# Altium schematic sheet bmp280_i2c.SchDoc
size A4
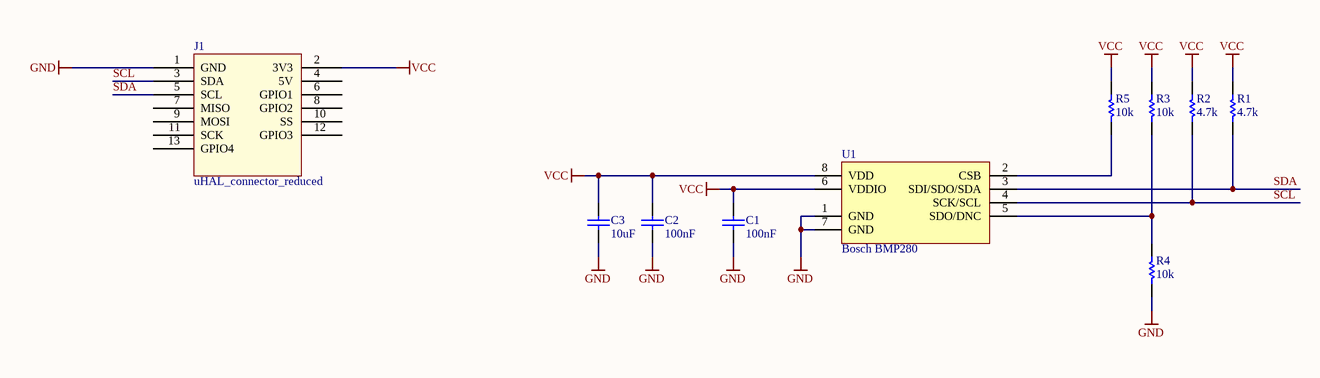
[diagram p0: bmp280_i2c.SchDoc]

## Parts
C1  Capacitance: 100nF  [CAPC1608X90X35ML10T15]  (hidden comment: Murata GCM188R71H104KA57D)
C2  Capacitance: 100nF  [CAPC1608X90X35ML10T15]  (hidden comment: Murata GCM188R71H104KA57D)
C3  Capacitance: 10uF  [CAPC1608X90X35ML10T15]  (hidden comment: Murata GCM188R71H104KA57D)
J1  uHAL_connector_reduced  [PCB-45ncoppm4oopozvqifsq-1]
R1  4.7k  [RESC1608X05N]
R2  4.7k  [RESC1608X05N]
R3  10k  [RESC1608X05N]
R4  10k  [RESC1608X05N]
R5  10k  [RESC1608X05N]
U1  Bosch BMP280  [PCB-7ktgzhb423iat7xn8psi-1]

## Nets
GND: C1.2 C2.2 C3.2 J1.1(GND) R4.1 U1.1(GND) U1.7(GND)
VCC: C1.1 C2.1 C3.1 J1.2(3V3) R1.2 R2.2 R3.2 R5.2 U1.6(VDDIO) U1.8(VDD)
SCL: J1.3(SDA) R2.1 U1.4(SCK/SCL)
SDA: J1.5(SCL) R1.1 U1.3(SDI/SDO/SDA)
NetR3_1: R3.1 R4.2 U1.5(SDO/DNC)
NetR5_1: R5.1 U1.2(CSB)

Not connected (* = marked no-connect by the designer): J1 4(5V) 6(GPIO1) 7(MISO) 8(GPIO2) 9(MOSI) 10(SS) 11(SCK) 12(GPIO3) 13(GPIO4)

## Library data of the parts
C1-C3 = CMP-119667-3: CAP CER 0.1UF 50V 10% X7R 0603; Lead-Free Status: Lead Free; Voltage Rating (DC): 50.0 V; Capacitance Tolerance: ±10%; Dielectric Characteristic: X7R; Octopart Url: https://octopart.com/gcm188r71h104ka57d-murata-7894792; OctopartID: 3480fdf266eeeb47; Packaging: Cut Tape (CT); REACH SVHC Compliance: No SVHC; RoHS: Compliant
J1 = CMP-2q23h2cwhjlfm8s6r7i8-1: connector for uHAL with reduced pin number; CustomComponentID: 2q23h2cwhjlfm8s6r7i8
R1-R5 = CMP-31acf99032f6ee6b-1: RCA Series 0603 0.1 W 0 O Jumper Surface Mount Thick Film Chip Resistor; Manufacturer Part Number: RCA06030000ZSEA; Lead-Free Status: Lead Free; Power Rating: 100 mW; Case/Package (SI): 1608; RoHS: Compliant; Case/Package: 0603, 1608; OctopartID: 31acf99032f6ee6b; Packaging: Cut Tape (CT); Octopart URL: https://octopart.com/rca06030000zsea-vishay-20325948
U1 = CMP-15503767-8: P-Sensor SPI I2C SMD; RoHS: Compliant; Manufacturer Part Number: BMP280; Octopart URL: https://octopart.com/bmp280-bosch+tools-26451306; OctopartID: f1e0397949ec2e27